# Altium schematic sheet Power.SchDoc
size A4
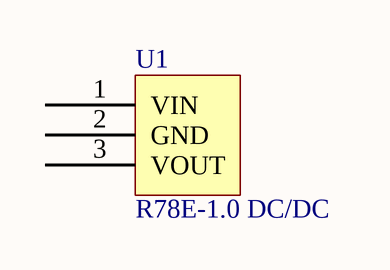
[diagram p0: Power.SchDoc]

## Parts
U1  R78E-1.0 DC/DC  [R78-1.0]

## Nets

Not connected (* = marked no-connect by the designer): U1 1(VIN) 2(GND) 3(VOUT)

## Library data of the parts
U1 = R78E-1.0